# Altium project IEEE_Robot_Mainboard.PrjPcb (part 2 of 2)

## Sheet Power.schdoc
size C; SheetNumber: 1; SheetTotal: 1
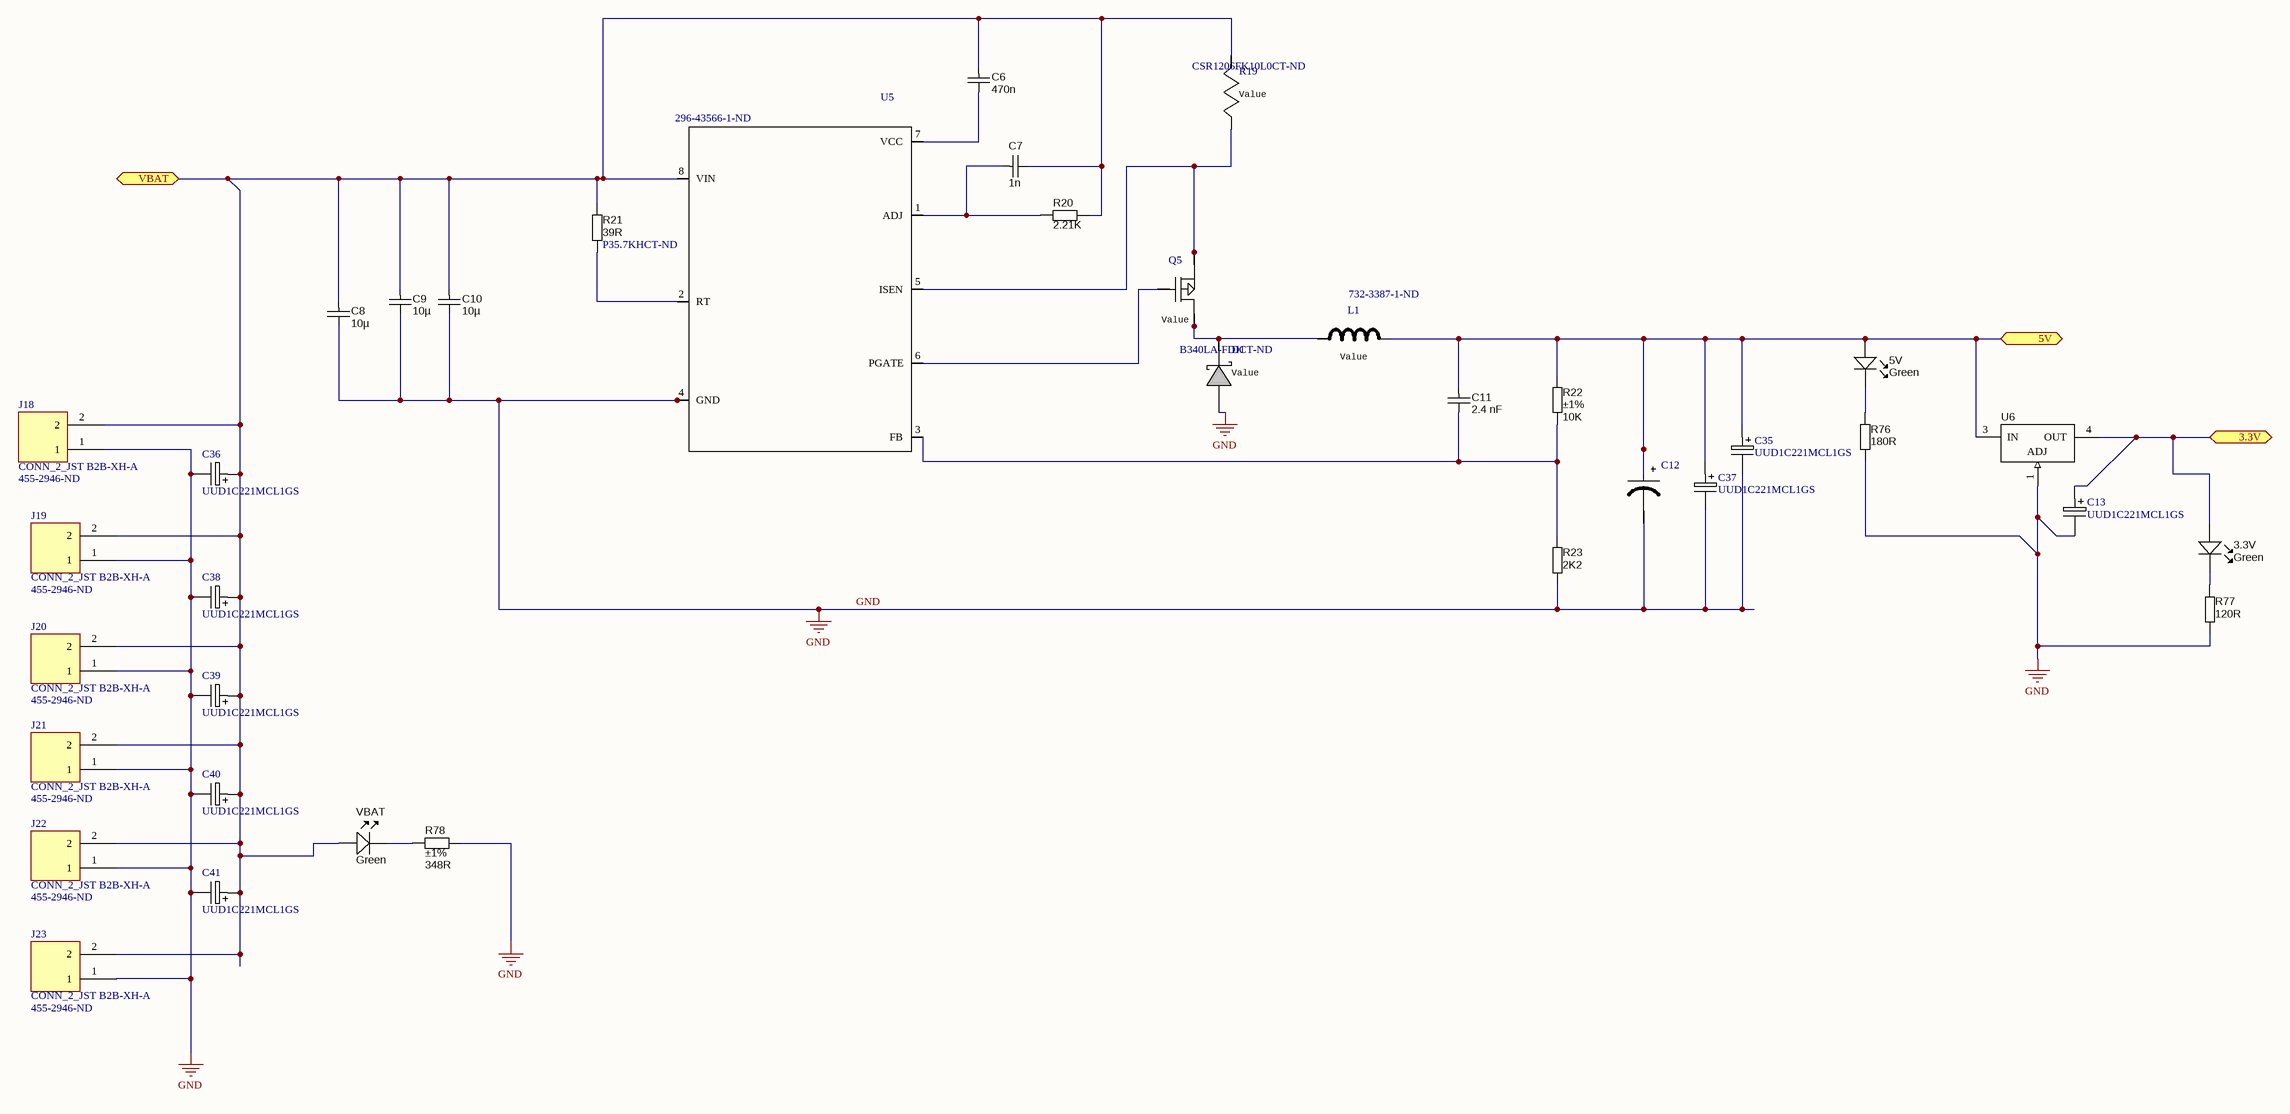
[diagram p4: Power.schdoc]

### Parts
3.3V  Green  [LED-0603-GREEN]
5V  Green  [LED-0603-GREEN]
C6  value 470n  [CAPC2012X135N]  (hidden comment: approved sub OK)
C7  value 1n  [CAPC1608X90N]  (hidden comment: approved sub OK)
C8  value 10µ  [CAPC3216X180N]  (hidden comment: approved sub OK)
C9  value 10µ  [CAPC3216X180N]  (hidden comment: approved sub OK)
C10  value 10µ  [CAPC3216X180N]  (hidden comment: approved sub OK)
C11  value 2.4 nF  [CAPC1608X90N]  (hidden comment: approved sub OK)
C12  6TPU47MSI  [CAPC2012X135N]  (value not drawn)
C13  UUD1C221MCL1GS  [NICH 6.3mm 7.7mm]
C35  UUD1C221MCL1GS  [NICH 6.3mm 7.7mm]
C36  UUD1C221MCL1GS  [NICH 6.3mm 7.7mm]
C37  UUD1C221MCL1GS  [NICH 6.3mm 7.7mm]
C38  UUD1C221MCL1GS  [NICH 6.3mm 7.7mm]
C39  UUD1C221MCL1GS  [NICH 6.3mm 7.7mm]
C40  UUD1C221MCL1GS  [NICH 6.3mm 7.7mm]
C41  UUD1C221MCL1GS  [NICH 6.3mm 7.7mm]
D1  Supplier Part Number 1: B340LA-FDICT-ND  [SMA]  (hidden comment: B340LA-13-F)
J18  CONN_2_JST B2B-XH-A  Supplier Part Number 1: 455-2946-ND  [CONN_JST_XT_TH_2]
J19  CONN_2_JST B2B-XH-A  Supplier Part Number 1: 455-2946-ND  [CONN_JST_XT_TH_2]
J20  CONN_2_JST B2B-XH-A  Supplier Part Number 1: 455-2946-ND  [CONN_JST_XT_TH_2]
J21  CONN_2_JST B2B-XH-A  Supplier Part Number 1: 455-2946-ND  [CONN_JST_XT_TH_2]
J22  CONN_2_JST B2B-XH-A  Supplier Part Number 1: 455-2946-ND  [CONN_JST_XT_TH_2]
J23  CONN_2_JST B2B-XH-A  Supplier Part Number 1: 455-2946-ND  [CONN_JST_XT_TH_2]
L1  Supplier Part Number 1: 732-3387-1-ND  [IND_WE-LHMI-SM]  (hidden comment: 74437368022)
Q5  CSD25402Q3A  [TRANS_NEXFET_Q3A]  (value not drawn)
R19  Supplier Part Number 1: CSR1206FK10L0CT-ND  [1206]  (hidden comment: CSR1206FK10L0)
R20  value 2.21K  [RESC1608X55N]  (hidden comment: Thick Film)
R21  value 39R  Supplier Part Number 1: P35.7KHCT-ND  [RESC1608X55N]  (hidden comment: Thick Film)
R22  value 10K  Tolerance: ±1%  [RESC1608X55N]  (hidden comment: Thick Film)
R23  value 2K2  [RESC1608X55N]  (hidden comment: Thick Film)
R76  value 180R  [RESC1608X55N]  (hidden comment: Thick Film)
R77  value 120R  [RESC1608X55N]  (hidden comment: Thick Film)
R78  value 348R  Tolerance: ±1%  [RESC1608X55N]  (hidden comment: Thin Film)
U5  Supplier Part Number 1: 296-43566-1-ND  [MUY08A]  (hidden comment: LM25085AMY/NOPB)
U6  LD1085D2T33R  [D2PAK-3]  (value not drawn)
VBAT  Green  [LED-0603-GREEN]

### Ports
3.3V, 5V, VBAT

### Nets
GND: C8.2 C9.2 C10.2 C12.2(-) C13.- C35.- C36.- C37.- C38.- C39.- C40.- C41.- D1.2(A) J18.1 J19.1 J20.1 J21.1 J22.1 J23.1 R23.2 R76.2 R77.2 R78.2 U5.4(GND) U5.9(GND) U6.1(ADJ)
3.3V: 3.3V.A C13.+ U6.4(OUT) ; port 3.3V
5V: 5V.A C11.1 C12.1(+) C35.+ C37.+ L1.2 R22.1 U6.3(IN) ; port 5V
VBAT: C6.1 C7.2 C8.1 C9.1 C10.1 C36.+ C38.+ C39.+ C40.+ C41.+ J18.2 J19.2 J20.2 J21.2 J22.2 J23.2 R19.1 R20.2 R21.1 U5.8(VIN) VBAT.A ; port VBAT
Net3.3V_K: 3.3V.K R77.1
Net5V_K: 5V.K R76.1
NetC6_2: C6.2 U5.7(VCC)
NetC7_1: C7.1 R20.1 U5.1(ADJ)
NetC11_2: C11.2 R22.2 R23.1 U5.3(FB)
NetD1_1: D1.1(K) L1.1 Q5.1(Drain) Q5.2(Drain) Q5.3(Drain)
NetQ5_4: Q5.4(Gate) U5.6(PGATE)
NetQ5_5: Q5.5(Source) Q5.6(Source) Q5.7(Source) Q5.8(Source) Q5.9(Source) R19.2 U5.5(ISEN)
NetR21_2: R21.2 U5.2(RT)
NetR78_1: R78.1 VBAT.K

### Library data of the parts
3.3V 5V VBAT = LED_SMD_Green_0603_525nm_350mcd: LED 0603 SMD Green 525nm 350mcd 20mA; Ratings: 200mcd min; 350 mcd typ @ 20mA; Voltage - Forward (Vf) @ 10mA: 3.1V; Viewing Angle: 120°; Lens Style/Size: Rectangle with Flat Top, 1.2mm x 0.8mm; Voltage - Forward (Vf) @ 20mA: 3.3V; SCDType: source; Package / Case: 0603 (1608 metric); Material: InGaN; Color: Green; Current - Test: 20mA; ComponentLink1URL: http://www.mouser.com/ds/2/216/APT1608ZGCK-262051.pdf; ComponentLink1Description: http://www.mouser.com/ds/2/216/APT1608ZGCK-262051.pdf; ComponentLink2Description: APT1608-WAP24 Datasheet; ComponentLink2URL: \\SVFI2\PBLShare\Eng\Electrical Engineering\Hardware\Altium\Libraries and Templates\Unreleased Components\Part Number Request 2013-10-02\APT1608-WAP24(Ver.1B).pdf; Supplier 1: Digi-Key; Supplier Part Number 1: 160-1183-1-ND
C6 = CAPC_470n_0805_X7R_16V_10%: Capacitor SMD Cer 470nF 10% 16V X7R 0805; Manufacturer 1: AVX Corporation; Manufacturer Part Number 1: 0805YC474KAT2A; Ratings: 16V; X7R; SCDType: undef; Supplier 1: Digi-Key; Supplier Part Number 1: 478-1403-1-ND; Tolerance: ±10%; Operating Temperature: -55°C ~ 125°C; Package / Case: 0805 (2012 metric)
C7 = CAPC_1n_0603_X7R_100V_10%: Capacitor SMD Cer 1nF 10% 100V X7R 0603; Manufacturer 1: Murata Electronics North America; Manufacturer Part Number 1: GCM188R72A102KA37D; Ratings: 100V; X7R; Material: ceramic; SCDType: spec; Package / Case: 0603 (1608 metric); Tolerance: ±10%; Supplier 1: Digi-Key; Supplier Part Number 1: 490-4780-1-ND; Operating Temperature: -55°C ~ 125°C; Size / Dimension: 0.063" L x 0.031" W (1.60mm x 0.80mm); Thickness (Max): 0.035" (0.90mm); ComponentLink1URL: http://search.murata.co.jp/Ceramy/image/img/PDF/ENG/GCM188R72A102KA37.pdf; ComponentLink1Description: http://search.murata.co.jp/Ceramy/image/img/PDF/ENG/GCM188R72A102KA37.pdf
C8-C10 = CAPC_10u_1206_16V: Capacitor SMD Cer 10uF 10% 16V X7R 1206; Manufacturer 1: Kemet; Manufacturer Part Number 1: C1206C106K4RACTU; Ratings: 16V; X7R; Material: ceramic; SCDType: spec; Package / Case: 1206 (3216 metric); Tolerance: ±10%; Supplier 1: Digi-Key; Supplier Part Number 1: 399-3525-1-ND
C11 = CAPC_2n4_50V_0603: Capacitor SMD Cer 2400pF  50V NP0 0603; Tolerance: ±0.25pF; Ratings: 100V; NP0; SCDType: source*; Operating Temperature: -55°C ~ 125°C; Package / Case: 0603 (1608 metric); Supplier 1: Digi-Key; Supplier Part Number 1: 490-3282-1-ND
C12 = CAPT_47u_6.3V_0805_6TPU47MSI: CAP TANT POLY 47UF 6.3V 0805; Vendor: Panasonic; Manufacturer_Part_Number: 6TPU47MSI; Manufacturer_Name: Panasonic; RefDes: RefDes; TYPE: TYPE; Value: Value; Supplier 1: Digi-Key; Supplier Part Number 1: P16212CT-ND
C13 C35-C41 = NICHICON_220uF_16V: GENERIC CAPACITOR POLARISED; Supplier 1: Digi-Key; Supplier Part Number 1: 493-2264-1-ND
D1 = B340LA-13-F: Imported; Vendor: Diodes Inc.; Value: Value; Manufacturer_Part_Number: B340LA-13-F; Manufacturer_Name: Diodes Inc.; RefDes: RefDes; Type: Type; Supplier 1: Digi-Key
J18-J23 = CONN_2_JST B2B-XH-A: CONN HEADER XH SIDE 2POS 2.5MM; Supplier 1: Digi-Key
L1 = 74437368022: Imported; Manufacturer: Wurth Elektronik; Vendor: Wurth Elektronik eiSos; Value: Value; Manufacturer_Part_Number: 74437368022; PACKAGE_DESIGNATOR: IND_WE-LHMI-SM; Manufacturer_Name: Wurth Elektronik; RefDes: RefDes; TYPE: TYPE; Supplier 1: Digi-Key
Q5 = CSD25402Q3A: Imported; Manufacturer: Texas Instruments; CompType: MOSFET; ChType: P; VdsMax_V: -20; Value1: 0.0077 ohm; Rdson45_ohm: 0.0077; Value2: 7.5 nC; QgTyp_nC: 7.5; Vgs_V: 12; IdsMax_A: -15; PIN_COUNT: 9; PackageReference: SON 3.3x3.3mm; Value: Value; PartNumber: CSD25402Q3A; RoHS: Y; MountType: SMT; Published: 2008-06-19; LatestRevisionNote: Added parts.; Supplier 1: Digi-Key; Supplier Part Number 1: 296-38916-1-ND; RefDes: RefDes; TYPE: TYPE; Manufacturer_Part_Number: CSD25402Q3A; Manufacturer_Name: Texas Instruments
R19 = CSR1206FK10L0: Imported; Vendor: Stackpole Electronics Inc; Value: Value; Manufacturer_Part_Number: CSR1206FK10L0; Manufacturer_Name: Stackpole Electronics Inc; RefDes: RefDes; TYPE: TYPE; Supplier 1: Digi-Key
R20 = RES_2.21K_0603_1%: Resistor SMD chip 2.21k Ohm 0.1W 1% 0603; Ratings: 1/10 W; Tolerance: ±5%; SCDType: spec; Temperature Coefficient: ±100ppm/°C; Package / Case: 0603 (1608 metric); Material: Thick Film; ComponentLink1URL: http://www.yageo.com/documents/recent/PYu-RC0603_51_RoHS_L_4.pdf; ComponentLink1Description: http://www.yageo.com/documents/recent/PYu-RC0603_51_RoHS_L_4.pdf; ComponentLink2URL: http://www.samsungsem.com/servlet/FileDownload?filename=productcatalog/pdf/Chip_Resistor.pdf; ComponentLink2Description: http://www.samsungsem.com/servlet/FileDownload?filename=productcatalog/pdf/Chip_Resistor.pdf; ComponentLink3URL: http://www.seielect.com/Catalog/SEI-RMCF_RMCP.pdf; ComponentLink3Description: http://www.seielect.com/Catalog/SEI-RMCF_RMCP.pdf; ComponentLink4URL: http://rohmfs.rohm.com/en/products/databook/datasheet/passive/resistor/chip_resistor/mcr_g.pdf; ComponentLink4Description: http://rohmfs.rohm.com/en/products/databook/datasheet/passive/resistor/chip_resistor/mcr_g.pdf; ComponentLink5URL: http://industrial.panasonic.com/www-cgi/jvcr13pz.cgi?E+PZ+3+AOA0001+ERJ3GEYJ222V+7+WW; ComponentLink5Description: http://industrial.panasonic.com/www-cgi/jvcr13pz.cgi?E+PZ+3+AOA0001+ERJ3GEYJ222V+7+WW; Supplier 1: Digi-Key; Supplier Part Number 1: P2.21KHCT-ND
R21 = RES_35.7K_0603_1%: Resistor SMD chip 35.7K Ohm 0.1W 1% 0603; Ratings: 1/10 W; Tolerance: ±5%; SCDType: spec; Package / Case: 0603 (1608 metric); ComponentLink1URL: http://www.vishay.com/doc?20035; ComponentLink1Description: http://www.vishay.com/doc?20035; ComponentLink2URL: http://www.yageo.com/documents/recent/PYu-RC0603_51_RoHS_L_4.pdf; ComponentLink2Description: http://www.yageo.com/documents/recent/PYu-RC0603_51_RoHS_L_4.pdf; Supplier 1: Digi-Key
R22 = RES_10K_0603_1%: Resistor SMD chip 10k Ohm 0.1W 1% 0603; Manufacturer 1: Yageo; Manufacturer Part Number 1: RC0603FR-0710KL; Ratings: 1/10W; SCDType: spec; Package / Case: 0603 (1608 Metric); Supplier 1: Digi-Key; Supplier Part Number 1: 311-10.0KHRCT-ND
R23 = RES_2K2_0603_1%: Resistor SMD chip 2.2k Ohm 0.1W 1% 0603; Ratings: 1/10 W; Tolerance: ±5%; SCDType: spec; Temperature Coefficient: ±100ppm/°C; Package / Case: 0603 (1608 metric); Material: Thick Film; ComponentLink1URL: http://www.yageo.com/documents/recent/PYu-RC0603_51_RoHS_L_4.pdf; ComponentLink1Description: http://www.yageo.com/documents/recent/PYu-RC0603_51_RoHS_L_4.pdf; ComponentLink2URL: http://www.samsungsem.com/servlet/FileDownload?filename=productcatalog/pdf/Chip_Resistor.pdf; ComponentLink2Description: http://www.samsungsem.com/servlet/FileDownload?filename=productcatalog/pdf/Chip_Resistor.pdf; ComponentLink3URL: http://www.seielect.com/Catalog/SEI-RMCF_RMCP.pdf; ComponentLink3Description: http://www.seielect.com/Catalog/SEI-RMCF_RMCP.pdf; ComponentLink4URL: http://rohmfs.rohm.com/en/products/databook/datasheet/passive/resistor/chip_resistor/mcr_g.pdf; ComponentLink4Description: http://rohmfs.rohm.com/en/products/databook/datasheet/passive/resistor/chip_resistor/mcr_g.pdf; ComponentLink5URL: http://industrial.panasonic.com/www-cgi/jvcr13pz.cgi?E+PZ+3+AOA0001+ERJ3GEYJ222V+7+WW; ComponentLink5Description: http://industrial.panasonic.com/www-cgi/jvcr13pz.cgi?E+PZ+3+AOA0001+ERJ3GEYJ222V+7+WW; Supplier 1: Digi-Key; Supplier Part Number 1: 311-2.20KHRCT-ND
R76 = RES_180R_0603_5%: Resistor SMD chip 180 Ohm 0.1W 5% 0603; Manufacturer 1: Vishay Dale; Manufacturer Part Number 1: CRCW0603180RJNEA; Ratings: 1/10 W; SCDType: spec; Package / Case: 0603 (1608 metric); Tolerance: ±5%; Material: Thick Film; Supplier 1: Digi-Key; Supplier Part Number 1: 541-180GCT-ND; ComponentLink1URL: http://www.vishay.com/doc?20035; ComponentLink1Description: http://www.vishay.com/doc?20035; Supplier 2: Digi-Key; Supplier Part Number 2: 311-180GRCT-ND; ComponentLink2URL: http://www.yageo.com/documents/recent/PYu-RC0603_51_RoHS_L_4.pdf; ComponentLink2Description: http://www.yageo.com/documents/recent/PYu-RC0603_51_RoHS_L_4.pdf; Manufacturer 2: Yageo; Manufacturer Part Number 2: RC0603JR-07180RL
R77 = RES_120R_0603_5%: Resistor SMD chip 120 Ohm 0.1W 5% 0603; Manufacturer 1: Vishay Dale; Manufacturer Part Number 1: CRCW0603120RJNEA; Ratings: 1/10 W; SCDType: spec; Package / Case: 0603 (1608 metric); Tolerance: ±5%; Material: Thick Film; Supplier 1: Digi-Key; Supplier Part Number 1: 541-120GCT-ND; ComponentLink1URL: http://www.vishay.com/doc?20035; ComponentLink1Description: http://www.vishay.com/doc?20035; Supplier 2: Digi-Key; Supplier Part Number 2: 311-120GRCT-ND; Manufacturer 2: Yageo; Manufacturer Part Number 2: RC0603JR-07120RL; ComponentLink2URL: http://www.yageo.com/documents/recent/PYu-RC0603_51_RoHS_L_4.pdf; ComponentLink2Description: http://www.yageo.com/documents/recent/PYu-RC0603_51_RoHS_L_4.pdf
R78 = RES_348R_0603_1%: Resistor SMD chip 348 Ohm 0.1W 1% 0603; Manufacturer 1: Yageo; Manufacturer Part Number 1: RC0603FR-07348RL; Ratings: 1/10 W; SCDType: spec; Package / Case: 0603 (1608 metric); Material: Thin Film; Supplier 1: Digi-Key; Supplier Part Number 1: 311-348HRCT-ND
U5 = LM25085AMY/NOPB: Imported; Manufacturer_Part_Number: LM5085MY/NOPB; Vendor: Texas Instruments; Value: Value; Manufacturer_Name: Texas Instruments; RefDes: RefDes; TYPE: TYPE; Supplier 1: Digi-Key
U6 = LD1085D2T33R: Voltage Regulator IC, IC REG LDO 3.3V 3A D2PAK; Voltage Regulator Type: Adjustable Positive Linear; Tolerance: 0.04%; Ratings: 40V; 1.5A; Value: variable; SCDType: spec*; Package / Case: D2PAK; Supplier 1: Digi-Key; Supplier Part Number 1: 497-1222-1-ND

## Nets that join several sheets
GND: Main (135 pins), MC1 (16 pins), MC2 (16 pins), MC3 (16 pins), MC4 (16 pins), Power (26 pins)
3.3V: Main (83 pins), MC1 (MODEMC1.2 TR1MC1.2), MC2 (MODEMC2.2 TR1MC2.2), MC3 (MODEMC3.2 TR1MC3.2), MC4 (MODEMC4.2 TR1MC4.2), Power (3.3V.A C13.+ U6.4)
5V: Main (50 pins), Power (8 pins)
A_OUT1: Main (MTR1.1 MTR1.3), MC1 (Q1_MC1.S Q3_MC1.D U1_MC1.7)
A_OUT2: Main (MTR2.1 MTR2.3), MC2 (Q1_MC2.S Q3_MC2.D U1_MC2.7)
A_OUT3: Main (MTR3.1 MTR3.3), MC3 (Q1_MC3.S Q3_MC3.D U1_MC3.7)
A_OUT4: Main (MTR4.1 MTR4.3), MC4 (Q1_MC4.S Q3_MC4.D U1_MC4.7)
AIOUT1: Main (R10.2), MC1 (U1_MC1.15)
AIOUT2: Main (R13.2), MC2 (U1_MC2.15)
AIOUT3: Main (R62.2), MC3 (U1_MC3.15)
AIOUT4: Main (R63.2), MC4 (U1_MC4.15)
B_OUT1: Main (MTR1.5 MTR1.7), MC1 (Q2_MC1.S Q4_MC1.D U1_MC1.9)
B_OUT2: Main (MTR2.5 MTR2.7), MC2 (Q2_MC2.S Q4_MC2.D U1_MC2.9)
B_OUT3: Main (MTR3.5 MTR3.7), MC3 (Q2_MC3.S Q4_MC3.D U1_MC3.9)
B_OUT4: Main (MTR4.5 MTR4.7), MC4 (Q2_MC4.S Q4_MC4.D U1_MC4.9)
ENABLE1: Main (U2.3), MC1 (ENMC1.A U1_MC1.18)
ENABLE2: Main (U2.5), MC2 (ENMC2.A U1_MC2.18)
ENABLE3: Main (U2.6), MC3 (ENMC3.A U1_MC3.18)
ENABLE4: Main (U2.9), MC4 (ENMC4.A U1_MC4.18)
PHASE1: Main (U3.4), MC1 (PHMC1.A U1_MC1.19)
PHASE2: Main (U3.5), MC2 (PHMC2.A U1_MC2.19)
PHASE3: Main (U3.6), MC3 (PHMC3.A U1_MC3.19)
PHASE4: Main (U3.7), MC4 (PHMC4.A U1_MC4.19)
VBAT: MC1 (7 pins), MC2 (7 pins), MC3 (7 pins), MC4 (7 pins), Power (21 pins)